# EAGLE design esp32_LoRa_relay_pump (EAGLE 9.6.0)

## Sheet 1 of 2
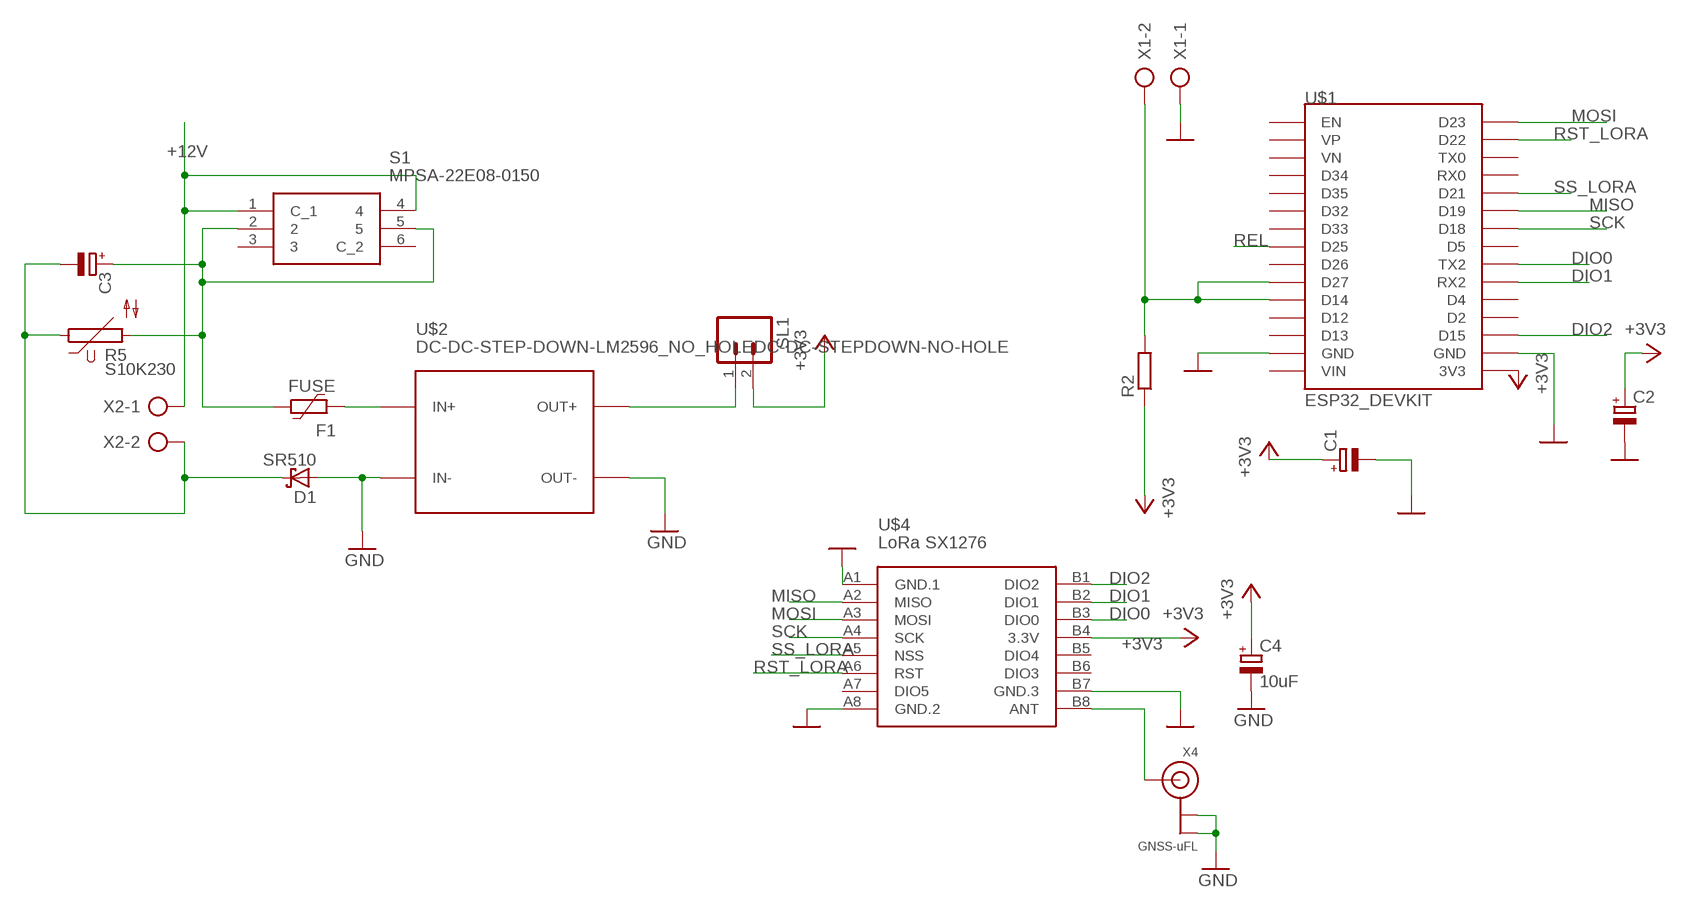
[diagram p0: schematic, sheet 1]

### Parts
C1  CPOL-EUE5-8.5  [E5-8,5]
C2  CPOL-EUE5-8.5  [E5-8,5]
C3  CPOL-EUE5-13  [E5-13]
C4  10uF  CPOL-EUE2.5-6  [E2,5-6]
D1  SR510  SCHOTTKY-DIODESMD  [SMB]
F1  FUSE  1812L010  [1812L]
R2  R-EU_0309/12  [0309/12]
R5  S10K230  [S10K230]
S1  MPSA-22E08-0150  [MPSA22E080150]
SL1  M02  [02P]
U$1  ESP32_DEVKIT  [ESP32_DEVKIT]
U$2  DC-DC-STEP-DOWN-LM2596_NO_HOLEDC-DC-STEPDOWN-NO-HOLE  [DC-DC-STEP-DOWN-LM2596_NO_HOLE]
U$4  LoRa SX1276  WIRELESS-LORA-RFM95W#SMD  [WIRELESS-LORA-RFM95W#SMD]
X1  AK300/2  [AK300/2]
X2  AK300/2  [AK300/2]
X4  GNSS-uFL  ANTENNA_U.FL  [U.FL]

### Nets
+3V3: C1.+ C2.+ C4.+ R2.1 SL1.2 U$1.3V3 U$4.B4(3.3V) ; also sheet 2
+12V: S1.1(C_1) S1.4 X2.1 ; also sheet 2
DIO0: U$1.TX2 U$4.B3(DIO0)
DIO1: U$1.RX2 U$4.B2(DIO1)
DIO2: U$1.D15 U$4.B1(DIO2)
GND: C1.- C2.- C4.- D1.A U$1.GND@1(GND) U$1.GND@2(GND) U$2.IN- U$2.OUT- U$4.A1(GND.1) U$4.A8(GND.2) U$4.B7(GND.3) X1.1 X4.1(GND) X4.2(GND) ; also sheet 2
MISO: U$1.D19 U$4.A2(MISO)
MOSI: U$1.D23 U$4.A3(MOSI)
N$2: F1.2 U$2.IN+
N$3: SL1.1 U$2.OUT+
N$4: R2.2 U$1.D14 U$1.D27 X1.2
N$6: C3.- D1.C R5.1 X2.2
N$8: C3.+ F1.1 R5.2 S1.2 S1.5
N$37: U$4.B8(ANT) X4.3(SIGNAL)
REL: U$1.D25 ; also sheet 2
RST_LORA: U$1.D22 U$4.A6(RST)
SCK: U$1.D18 U$4.A4(SCK)
SS_LORA: U$1.D21 U$4.A5(NSS)
Unconnected: S1.3 S1.6(C_2) U$1.D2 U$1.D4 U$1.D5 U$1.D12 U$1.D13 U$1.D26 U$1.D32 U$1.D33 U$1.D34 U$1.D35 U$1.EN U$1.RX0 U$1.TX0 U$1.VIN U$1.VN U$1.VP U$4.A7(DIO5) U$4.B5(DIO4) U$4.B6(DIO3)

## Sheet 2 of 2
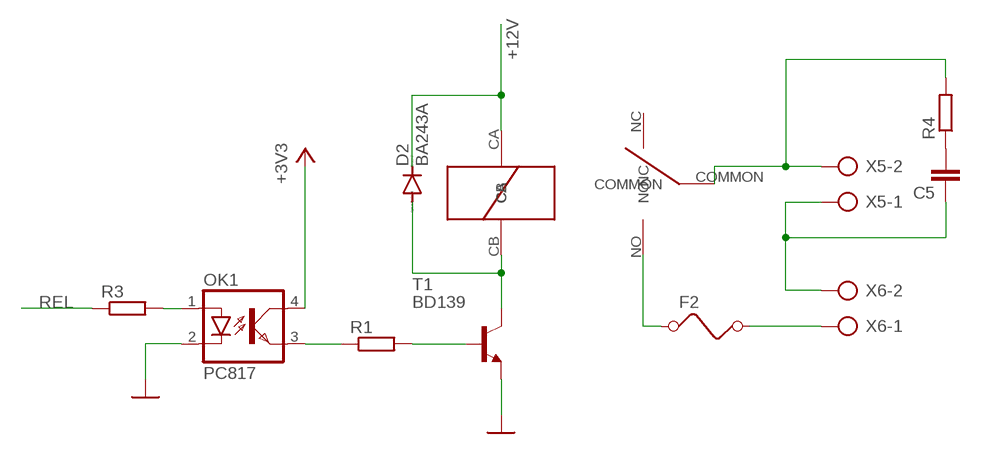
[diagram p1: schematic, sheet 2]

### Parts
C5  C-EU150-064X183  [C150-064X183]
D2  BA243A  [DO35-10]
F2  FUSE  [FUSE]
OK1  PC817  [DIL04]
R1  R-EU_M0805  [M0805]
R3  R-EU_M0805  [M0805]
R4  R-EU_0817/7V  [P0817V]
T1  BD139  [TO126]
U$3  SONGLE_30A  [RELAY_SONGLE_4PIN]
X5  AK300/2  [AK300/2]
X6  AK300/2  [AK300/2]

### Nets
+3V3: OK1.4(COL) ; also sheet 1
+12V: D2.C U$3.CA ; also sheet 1
GND: OK1.2(C) T1.1(E) ; also sheet 1
N$1: C5.2 R4.1
N$5: OK1.3(EMIT) R1.1
N$7: OK1.1(A) R3.2
N$9: R1.2 T1.3(B)
N$10: F2.1 U$3.NO
N$12: C5.1 X5.1 X6.2
N$14: R4.2 U$3.COMMON X5.2
N$15: D2.A T1.2(C) U$3.CB
N$16: F2.2 X6.1
REL: R3.1 ; also sheet 1
Unconnected: U$3.NC

## Library data of the parts
C1-C4 = rcl:CPOL-EU: POLARIZED CAPACITOR, European symbol; SPICEPREFIX: C
C5 = rcl:C-EU: CAPACITOR, European symbol; SPICEPREFIX: C
D1 = diode:SCHOTTKY-DIODE: Schottky Diode
D2 = diode:BA243A: DIODE
F1 = polyfuse-smd_10:?: Polyfuse Resettable PTC Source: http://www.littelfuse.com/products/resettable-ptcs.aspx; MF: Littelfuse; MPN: 1812L010; OC_FARNELL: 1822210; OC_NEWARK: 78R5551
F2 = special:FUSE: FUSE 5 x 20 mm
OK1 = optocoupler:PC817: SHARP OPTO COUPLER; MPN: PC817X4J000F; OC_FARNELL: 9707727; OC_NEWARK: 97K7059
R1-R4 = rcl:R-EU_: RESISTOR, European symbol; SPICEPREFIX: R
R5 = varistor:S10K230: VARISTOR
S1 = MPSA-22E08-0150:MPSA-22E08-0150: DPDT Momentary-On Push Button Switch, PCB Source: Datasheet <http://www.knitter-switch.com/eng/Series/17?search=MPSA-22E08-0150>; DESCRIPTION: DPDT Momentary-On Push Button Switch, PCB; HEIGHT: 8mm; MANUFACTURER_NAME: KNITTER-SWITCH; MANUFACTURER_PART_NUMBER: MPSA-22E08-0150; RS_PART_NUMBER: 9138895; RS_PRICE-STOCK: http://uk.rs-online.com/web/p/products/9138895
SL1 = con-amp-quick:M02: AMP QUICK CONNECTOR; OC_FARNELL: unknown; OC_NEWARK: unknown
T1 = transistor:BD139: NPN TRANSISTOR
U$1 = DOIT_ESP32_DEVKIT:ESP32_DEVKIT: ESP32 DEVKIT BOARD
U$2 = diy-modules:DC-DC-STEP-DOWN-LM2596_NO_HOLE: DC/DC Step-Down Regulator based on LM2596-ADJ chip LM2596 datasheet available here: http://www.ti.com/lit/ds/symlink/lm2596.pdf Click here to find device on ebay.com <http://www.ebay.com/sch/lm2596+power+regulator>
U$3 = songle_relay_30A:SONGLE_30A: relay 30 A 5 pin, create by mikroavr.com
U$4 = diy-modules:WIRELESS-LORA-RFM95W: 868/915 MHz LoRa Radio Transceiver Module based on SX1276 chip Click here to find device on ebay.com <http://www.ebay.com/sch/RFM95W+transceiver>
X1 X2 X5 X6 = con-ptr500:AK300/2: CONNECTOR; OC_FARNELL: unknown; OC_NEWARK: unknown
X4 = TimWoo-Connectors:ANTENNA_U.FL: U.FL Antenna Connector

## Net classes
0 default: width 0.152 mm, drill 0.152 mm, clearance 0.762 mm

## Board
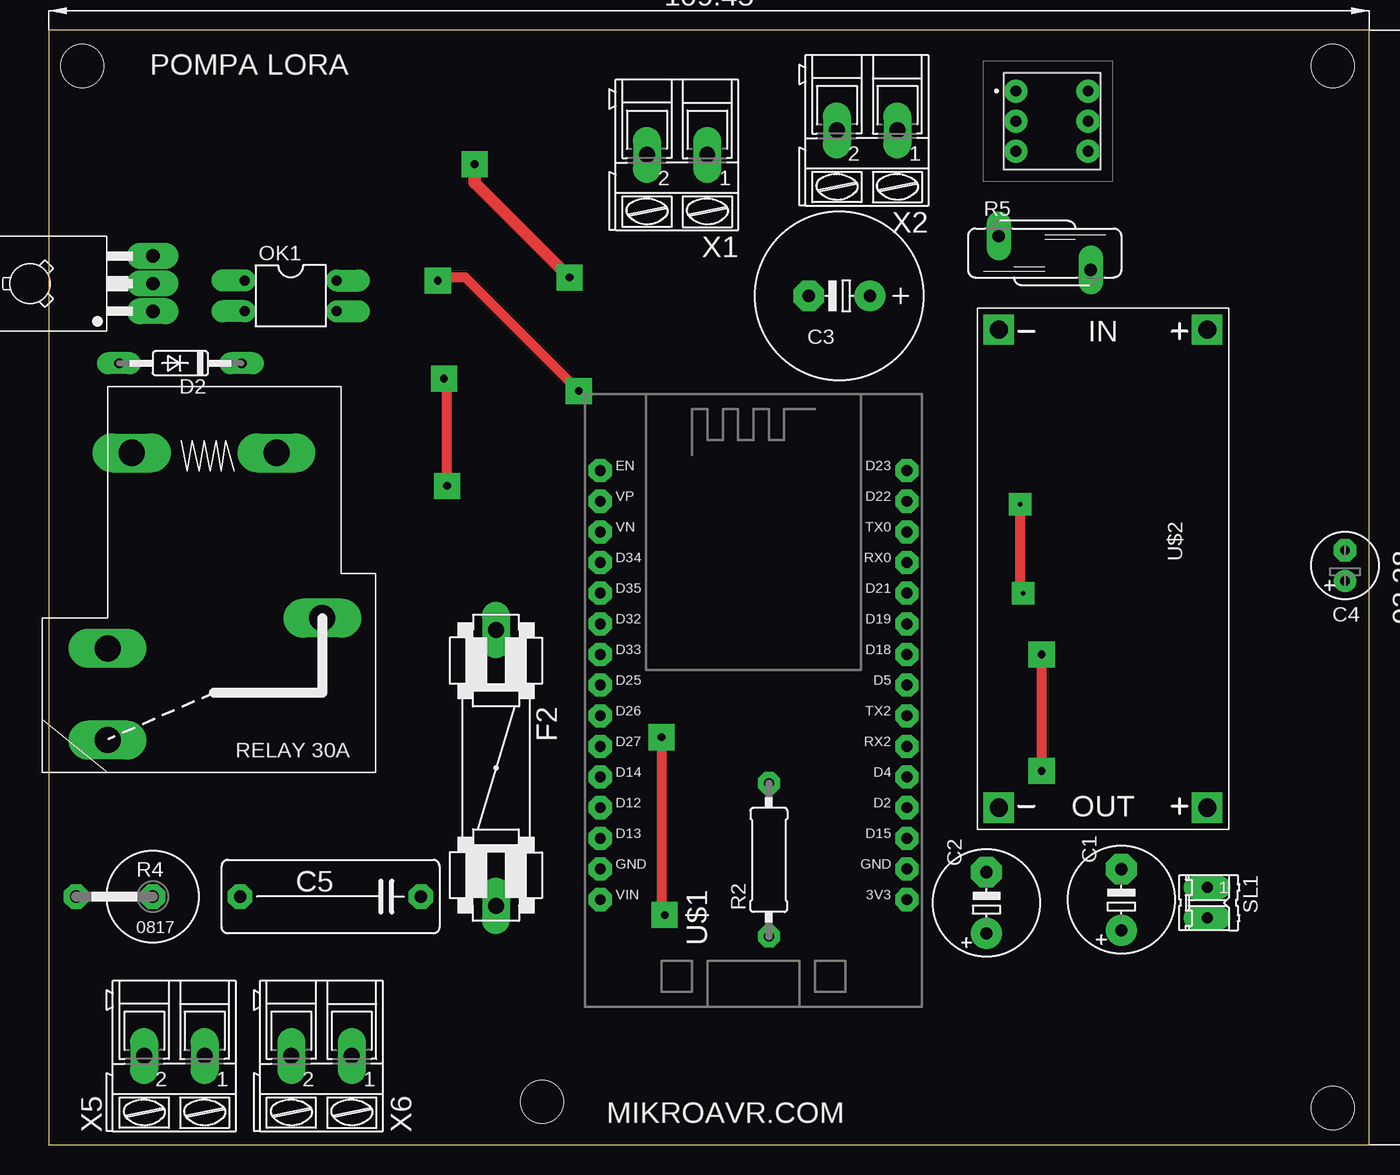
[diagram p2: board, top side]
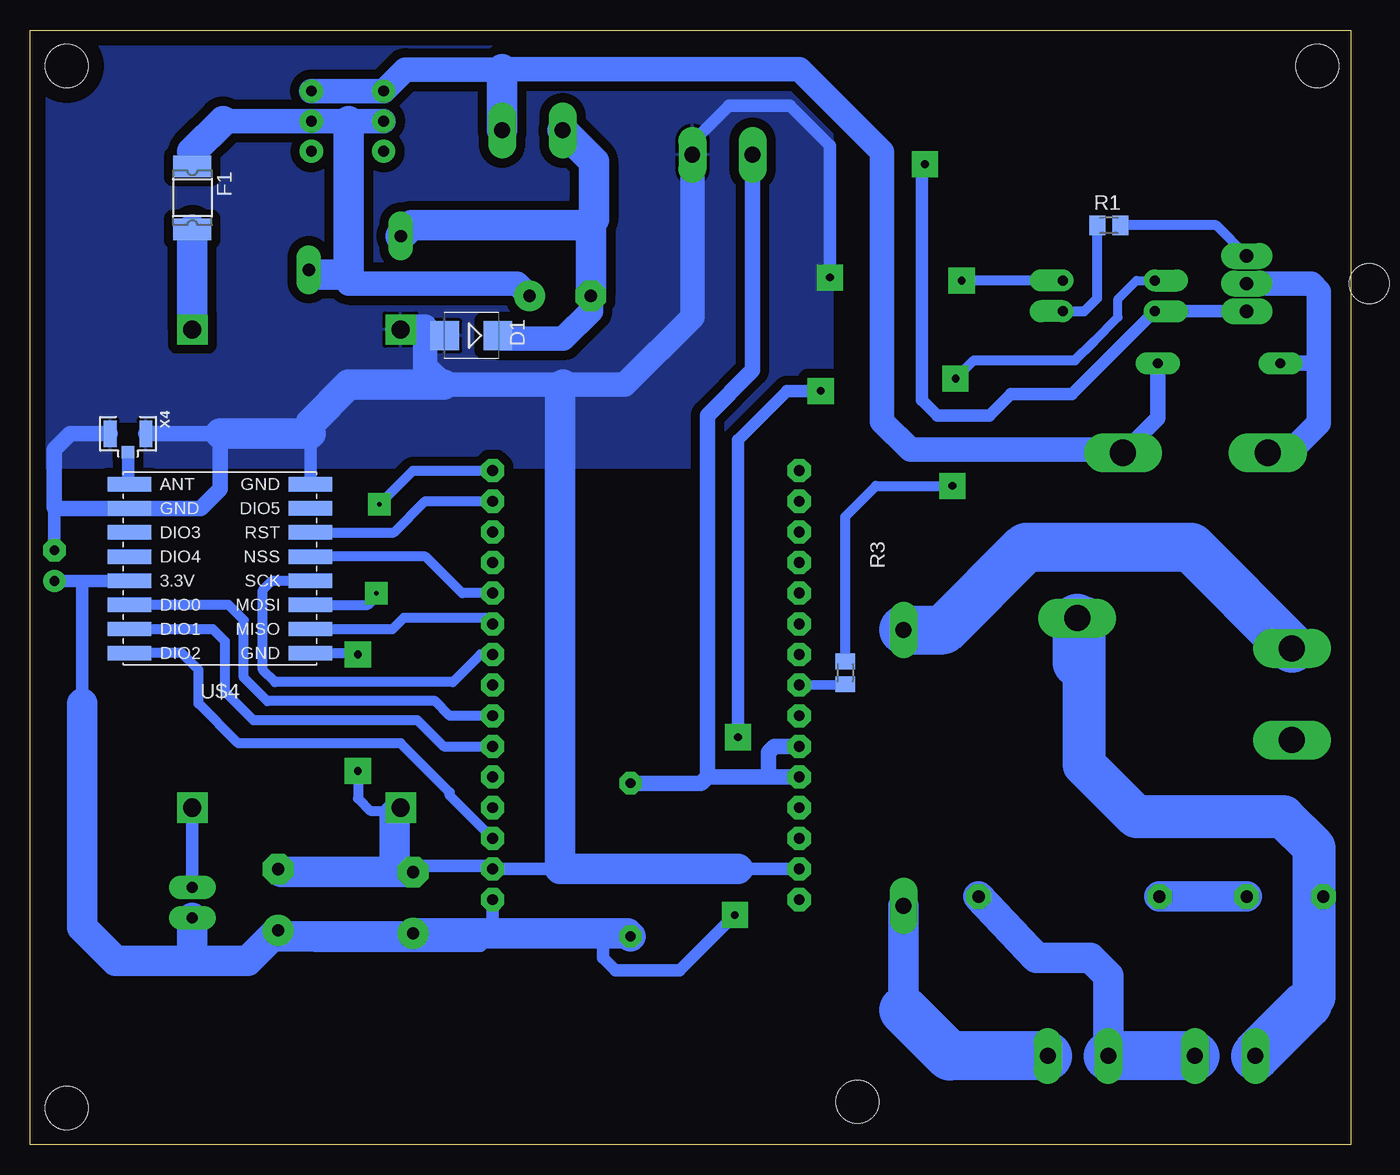
[diagram p3: board, bottom side, seen from below]

Size 109.45 x 92.38 mm. Coordinates in mm from the lower left corner, seen from the top.
Outline: 0,0 109.45,0 109.45,92.38 0,92.38 0,0
Copper layers (1*16): Top 0.035mm / dielectric 1.5mm / Bottom 0.035mm
Design rules "setting": minimum track width 30mil, minimum drill 25mil, track to track 30mil, track to pad 30mil, pad to pad 30mil, via to via 30mil, smd to smd 8mil, copper to edge 50mil, drill to drill 30mil, minimum pad ring 20mil, minimum via ring 30mil, stop-mask expansion 0mil, vias tented up to drill 0mil, thermal gap 10mil
Holes 3.56 mm at 2.79,89.41 40.89,3.56 106.43,3.05 106.43,89.41

### Footprints (pad centres in the part's own frame; a part is rotated, then mirrored left to right if it is on the bottom)
E5-8,5 = drill 1.016 pad 2.54: + -2.54,0 | drill 1.016 pad 2.54 octagon: - 2.54,0
E5-13 = drill 1.016 pad 2.54: + -2.54,0 | drill 1.016 pad 2.54 octagon: - 2.54,0
E2,5-6 = drill 0.813 pad 1.6: + -1.27,0 | drill 0.813 pad 1.6 octagon: - 1.27,0
C150-064X183 = drill 1.016 octagon: 1 -7.493,0; 2 7.493,0
SMB = smd 2.4 x 2.4: A 2.2,0; C -2.2,0
DO35-10 = drill 0.813 long: A 5.08,0; C -5.08,0
1812L = smd 1.78 x 3.15: 1 -2.62,0; 2 2.62,0
FUSE = drill 1.321 long: 1 -11.43,0; 2 11.43,0
DIL04 = drill 0.813 offset: 1 -1.27,-3.81; 2 1.27,-3.81; 3 1.27,3.81; 4 -1.27,3.81
M0805 = smd 1.3 x 1.6: 1 -0.95,0; 2 0.95,0
0309/12 = drill 0.813 octagon: 1 -6.35,0; 2 6.35,0
P0817V = drill 1.016 octagon: 1 -5.08,0; 2 1.27,0
S10K230 = drill 1.016 long: 1 -1.397,-3.81; 2 1.397,3.81
MPSA22E080150 = drill 0.9 pad 1.4: 1 -2.5,-2.65; 2 0,-2.65; 3 2.5,-2.65; 4 -2.5,3.35; 5 0,3.35; 6 2.5,3.35
02P = drill 0.914 long: 1 -1.27,0; 2 1.27,0
TO126 = drill 1.118 long: 1 -2.286,-5.08; 2 0,-5.08; 3 2.286,-5.08 | hole 3.302: 0,5.08
ESP32_DEVKIT = drill 0.9 pad 1.422 octagon: 3V3 11.43,-17.78; D2 11.43,-10.16; D4 11.43,-7.62; D5 11.43,0; D12 -13.97,-10.16; D13 -13.97,-12.7; D14 -13.97,-7.62; D15 11.43,-12.7; D18 11.43,2.54; D19 11.43,5.08; D21 11.43,7.62; D22 11.43,15.24; D23 11.43,17.78; D25 -13.97,0; D26 -13.97,-2.54; D27 -13.97,-5.08; D32 -13.97,5.08; D33 -13.97,2.54; D34 -13.97,10.16; D35 -13.97,7.62; EN -13.97,17.78; GND@1 -13.97,-15.24; GND@2 11.43,-15.24; RX0 11.43,10.16; RX2 11.43,-5.08; TX0 11.43,12.7; TX2 11.43,-2.54; VIN -13.97,-17.78; VN -13.97,12.7; VP -13.97,15.24
DC-DC-STEP-DOWN-LM2596_NO_HOLE = drill 1.5 pad 2.5 square: IN+ -19.812,8.636; IN- -19.812,-8.636; OUT+ 19.812,8.636; OUT- 19.812,-8.636
RELAY_SONGLE_4PIN = drill 2.159 long: CA -0.6,-22.3; CB 11.4,-22.3; COMMON -4.4,-8.6; NC 13.4,1.5; NO 13.4,-6.1
WIRELESS-LORA-RFM95W#SMD = smd 3.6 x 1.2: A1 -7.5,7; A2 -7.5,5; A3 -7.5,3; A4 -7.5,1; A5 -7.5,-1; A6 -7.5,-3; A7 -7.5,-5; A8 -7.5,-7; B1 7.5,7; B2 7.5,5; B3 7.5,3; B4 7.5,1; B5 7.5,-1; B6 7.5,-3; B7 7.5,-5; B8 7.5,-7
AK300/2 = drill 1.321 long: 1 -2.515,0; 2 2.489,0
U.FL = smd 2.2 x 1.05: 1 0,1.475; 2 0,-1.475 | smd 1.05 x 1.05: 3 1.525,0

### Placement (x,y rotation side)
C1  88.9,20.32 90 top
C2  77.72,20.07 90 top
C3  65.53,70.36 180 top
C4  107.44,48.01 90 top
C5  23.37,20.57 180 top
D1  72.9,67.06 180 bottom
D2  10.92,64.77 180 top
F1  96.01,78.49 270 bottom
F2  37.08,31.24 270 top
OK1  20.07,70.36 270 top
R1  20.07,76.2 0 bottom
R2  59.69,23.62 90 top
R3  41.91,39.12 90 bottom
R4  3.56,20.57 180 top
R5  82.55,73.91 270 top
S1  82.8,84.84 270 top
SL1  96.01,20.07 270 top
T1  3.56,71.37 90 top
U$1  59.69,38.1 0 top
U$2  87.38,47.75 270 top
U$3  18.29,35.05 180 top
U$4  93.73,47.75 180 bottom
X1  52.07,82.04 180 top
X2  67.82,84.07 180 top
X4  101.35,58.93 270 bottom
X5  10.41,7.37 180 top
X6  22.61,7.37 180 top

### Tracks (layer width: path | path; a pad name or v marks a point on that pad's centre or on a via)
+3V3  (via drill 0.64)
  Top 0.813: v43.94,62.48 34.54,71.88 32.51,71.88 v32.26,71.63 | v50.8,33.78 50.8,19.3 v51.05,19.05
  Bottom 0.813: OK1.4 v32.26,71.63
  Bottom 1.016: C4.+ 105.16,46.74 | 105.16,46.74 101.24,46.74 U$4.B4 | 105.16,21.84 105.16,23.37 | 105.16,36.58 105.16,46.74 | 71.12,17.53 U$1.3V3 | 96.01,15.24 90.93,15.24 88.9,17.27 C1.+ | 85.85,16.51 77.72,16.51 | 77.72,16.51 72.14,16.51 71.12,17.53 | C2.+ 77.72,16.51 | R2.1 70.87,17.27 71.12,17.53 | v43.94,62.48 46.74,62.48 50.8,58.42 v50.8,33.78 | v51.05,19.05 55.63,14.48 60.96,14.48 61.98,15.49 61.98,17.53
  Bottom 2.54: 88.9,17.27 77.98,17.27 C2.+ 61.98,17.53 59.94,17.53 R2.1 | C1.+ 91.44,15.24 96.01,15.24 | 96.01,15.24 102.36,15.24 105.16,18.03 105.16,23.37 105.16,36.58 | SL1.2 96.01,15.24
+12V
  Bottom 1.27: U$3.CA 16,60.24 D2.C
  Bottom 2.032: S1.4 S1.1 78.38,89.11 70.37,89.11 | 70.33,89.15 45.72,89.15 38.86,82.3 38.86,59.94 36.52,57.61 19.14,57.61 U$3.CA
  Bottom 2.54: 70.37,89.11 70.33,89.15 X2.1
DIO0
  Bottom 0.813: U$1.TX2 74.68,35.56 75.89,36.78 89.81,36.78 91.74,38.72 91.74,43.48 93.01,44.75 U$4.B3
DIO1
  Bottom 0.813: U$4.B2 94.31,42.75 93.32,41.76 93.32,37.56 90.97,35.2 77.37,35.2 75.18,33.02 U$1.RX2
DIO2
  Bottom 0.813: U$1.D15 74.68,28.96 74.68,29.21 78.74,33.27 92.2,33.27 95.5,36.58 95.5,39.37 96.89,40.75 U$4.B1
GND  (via drill 0.64)
  Top 0.813: v82.3,40.64 v82.3,30.99
  Top 1.016: v35.31,81.28 35.31,79.76 v43.18,71.88
  Bottom 0.813: 86.23,58.93 86.23,59.82 | U$4.A1 82.41,40.75 v82.3,40.64 | v82.3,30.99 82.3,28.7 81.28,27.69 78.99,27.69 U$2.OUT-
  Bottom 1.016: U$4.A8 86.23,58.93 | C4.- 107.44,52.83 107.36,52.75 | C1.- 88.65,23.11 79.25,23.11 78.74,23.11 | 78.74,23.11 77.98,23.11 | 77.98,23.11 71.37,23.11 U$1.GND@2 65.53,22.86 | C2.- 77.72,22.86 77.98,23.11 | U$2.OUT- 78.74,23.11 | 50.8,22.86 U$1.GND@1 | T1.1 OK1.2 23.11,62.23 28.19,62.23 29.97,60.45 34.29,60.45 35.56,61.72 35.56,81.03 v35.31,81.28 | v43.18,71.88 43.18,82.8 46.48,86.11 51.56,86.11 54.58,83.08 X1.1
  Bottom 1.27: 107.44,52.83 107.44,57.61 106.12,58.93 X4.2 | X4.1 93.73,58.93 93.73,54.36 95.33,52.75 U$4.B7 107.36,52.75
  Bottom 2.032: D1.A 76.71,67.06 | U$2.IN- 78.49,67.82 76.71,67.82 76.71,67.06 | X1.1 54.58,68.61 60.2,62.99 65.28,62.99 75.18,62.99 76.71,64.52 76.71,67.06
  Bottom 2.54: 86.23,59.82 83.06,62.99 75.18,62.99 | 93.73,58.93 86.23,58.93 | C2.- 88.65,22.61 C1.- | U$2.OUT- 79.25,27.43 79.25,23.11 | 65.28,62.99 65.53,62.74 65.53,22.86 50.8,22.86
  pour Bottom: 42.93,92.46 109.22,92.46 109.22,56.13 42.93,56.13
MISO
  Bottom 0.813: U$4.A2 79.42,42.75 78.49,43.69 71.63,43.69 U$1.D19
MOSI  (via drill 0.35)
  Top 0.813: v80.77,45.72 80.52,45.97 v80.52,53.09
  Bottom 0.813: U$4.A3 81.49,44.75 80.77,45.47 v80.77,45.72 | v80.52,53.09 77.72,55.88 U$1.D23
N$1
  Bottom 2.54: C5.2 R4.1
N$2
  Bottom 2.54: U$2.IN+ F1.2
N$3
  Bottom 1.016: SL1.1 U$2.OUT+
N$4
  Bottom 1.27: 48.26,30.48 U$1.D14 | U$1.D27 47.75,33.02 48.26,32.51 48.26,30.48 | X1.2 49.58,64.21 53.34,60.45 53.34,30.48 | 48.26,30.48 53.34,30.48 | 53.34,30.48 53.85,29.97 R2.2
N$5
  Bottom 0.813: OK1.3 22.1,69.09 21.02,70.17 R1.1
N$6
  Bottom 1.27: 62.99,76.2 62.74,76.45 62.74,78.23
  Bottom 2.032: D1.C 70.44,66.8 65.28,66.8 62.99,69.09 C3.-
  Bottom 2.54: X2.2 62.74,81.48 62.74,78.23 62.74,76.71 | C3.- 62.99,76.2 77.85,76.2 R5.1
N$7  (via drill 0.64)
  Top 0.813: v33.02,54.61 33.02,63.25 v32.77,63.5
  Bottom 0.762: 21.34,66.55 19.3,68.58 19.3,70.1 17.78,71.63 OK1.1
  Bottom 0.813: R3.2 41.91,52.07 39.37,54.61 v33.02,54.61 | v32.77,63.5 31.24,65.02 22.86,65.02 21.34,66.55
N$8
  Bottom 1.27: 85.98,72.14 R5.2 | 96.01,82.3 F1.1
  Bottom 2.032: C3.+ 69.09,71.37 83.06,71.37 83.06,72.14 | S1.2 83.06,84.84 S1.5 93.47,84.84
  Bottom 2.54: 85.98,72.14 83.06,72.14 83.06,84.84 | 93.47,84.84 96.01,82.3
N$9
  Bottom 0.813: T1.3 11.18,76.2 R1.2
N$10
  Bottom 4.064: F2.1 33.78,42.67 26.92,49.53 13.27,49.53 U$3.NO
N$12
  Bottom 2.54: X6.2 20.12,14.02 21.59,15.49 26.05,15.49 C5.1
  Bottom 4.064: X5.1 X6.2
N$14
  Bottom 1.27: R4.2 3.05,19.81 3.05,18.03
  Bottom 3.556: 3.61,11.68 3.05,12.24 3.05,18.03 3.05,24.64 5.59,27.18 17.78,27.18 22.1,31.5 22.1,43.69 22.65,43.69 U$3.COMMON
  Bottom 4.064: X5.2 3.61,11.68 | 22.69,39.96 U$3.COMMON
N$15
  Bottom 1.27: D2.A 2.65,64.77
  Bottom 2.032: U$3.CB 5.13,57.35 2.65,59.83 2.65,64.77 2.65,70.72 3.3,71.37 T1.2
N$16
  Bottom 2.54: 37.08,11.18 F2.2
  Bottom 4.064: X6.1 33.27,7.37 37.08,11.18
N$37
  Bottom 1.016: X4.3 101.35,54.87 U$4.B8
REL
  Bottom 0.813: U$1.D25 R3.1
RST_LORA
  Bottom 0.813: U$4.A6 79.3,50.75 76.71,53.34 U$1.D22
SCK
  Bottom 0.813: U$1.D18 72.14,40.64 74.42,38.35 89.15,38.35 90.17,39.37 90.17,45.97 89.39,46.75 U$4.A4
SS_LORA
  Bottom 0.813: U$1.D21 73.66,45.72 76.69,48.75 U$4.A5

### Text on the board
tPlace: POMPA LORA | MIKROAVR.COM